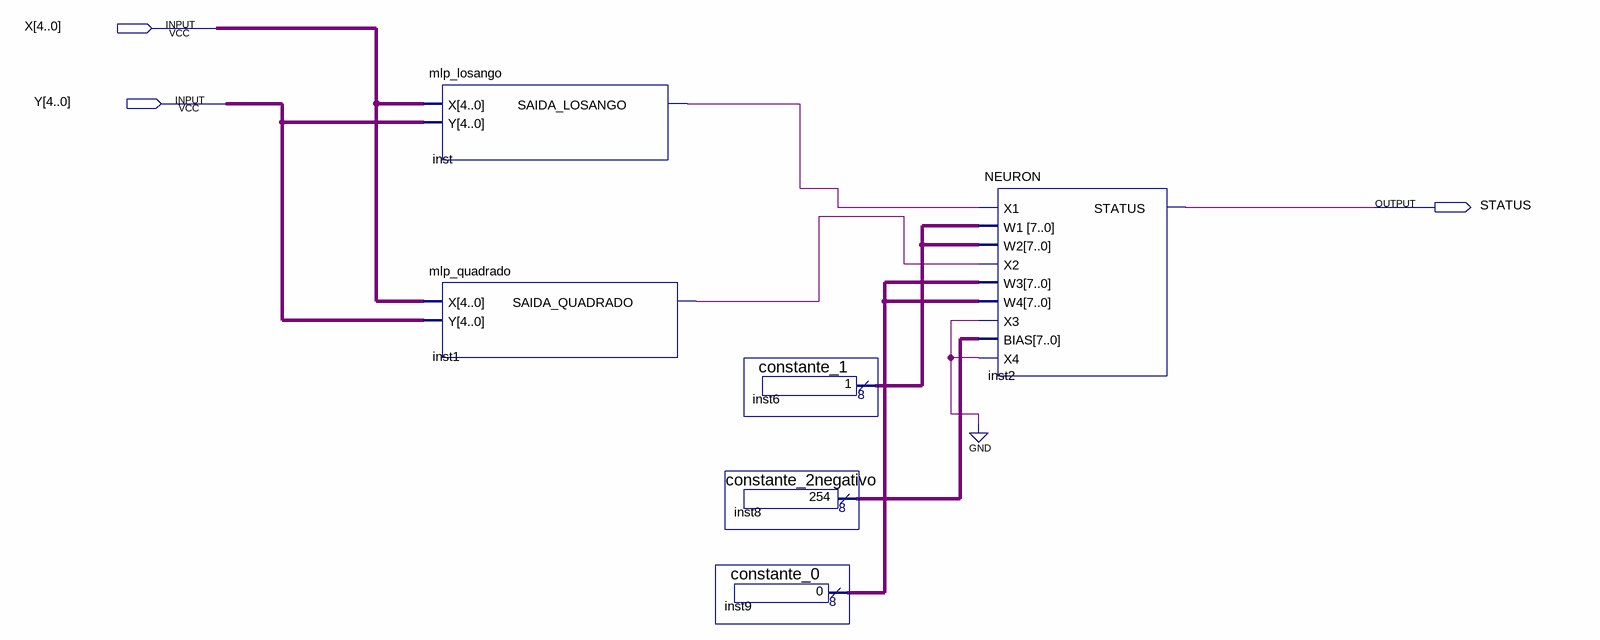
[diagram p0: schematic sheet]
// Quartus schematic mlp.bdf as structural Verilog: 6 symbols, 3 pins
module mlp (
  input  [4:0] X,
  input  [4:0] Y,
  output STATUS
);

  wire inst1_saida_quadrado, inst_saida_losango;
  wire [7:0] inst6_result, inst8_result, inst9_result;

  mlp_losango inst (.X(X), .Y(Y), .SAIDA_LOSANGO(inst_saida_losango));
  mlp_quadrado inst1 (.X(X), .Y(Y), .SAIDA_QUADRADO(inst1_saida_quadrado));
  constante_2negativo inst8 (.result(inst8_result));
  constante_0 inst9 (.result(inst9_result));
  constante_1 inst6 (.result(inst6_result));
  NEURON inst2 (
    .X1(inst_saida_losango), .W1(inst6_result), .W2(inst6_result), .X2(inst1_saida_quadrado),
    .W3(inst9_result), .W4(inst9_result), .X3(1'b0), .BIAS(inst8_result), .X4(1'b0), .STATUS(STATUS));
endmodule
